# EAGLE schematic untitled (EAGLE 8.0.1)
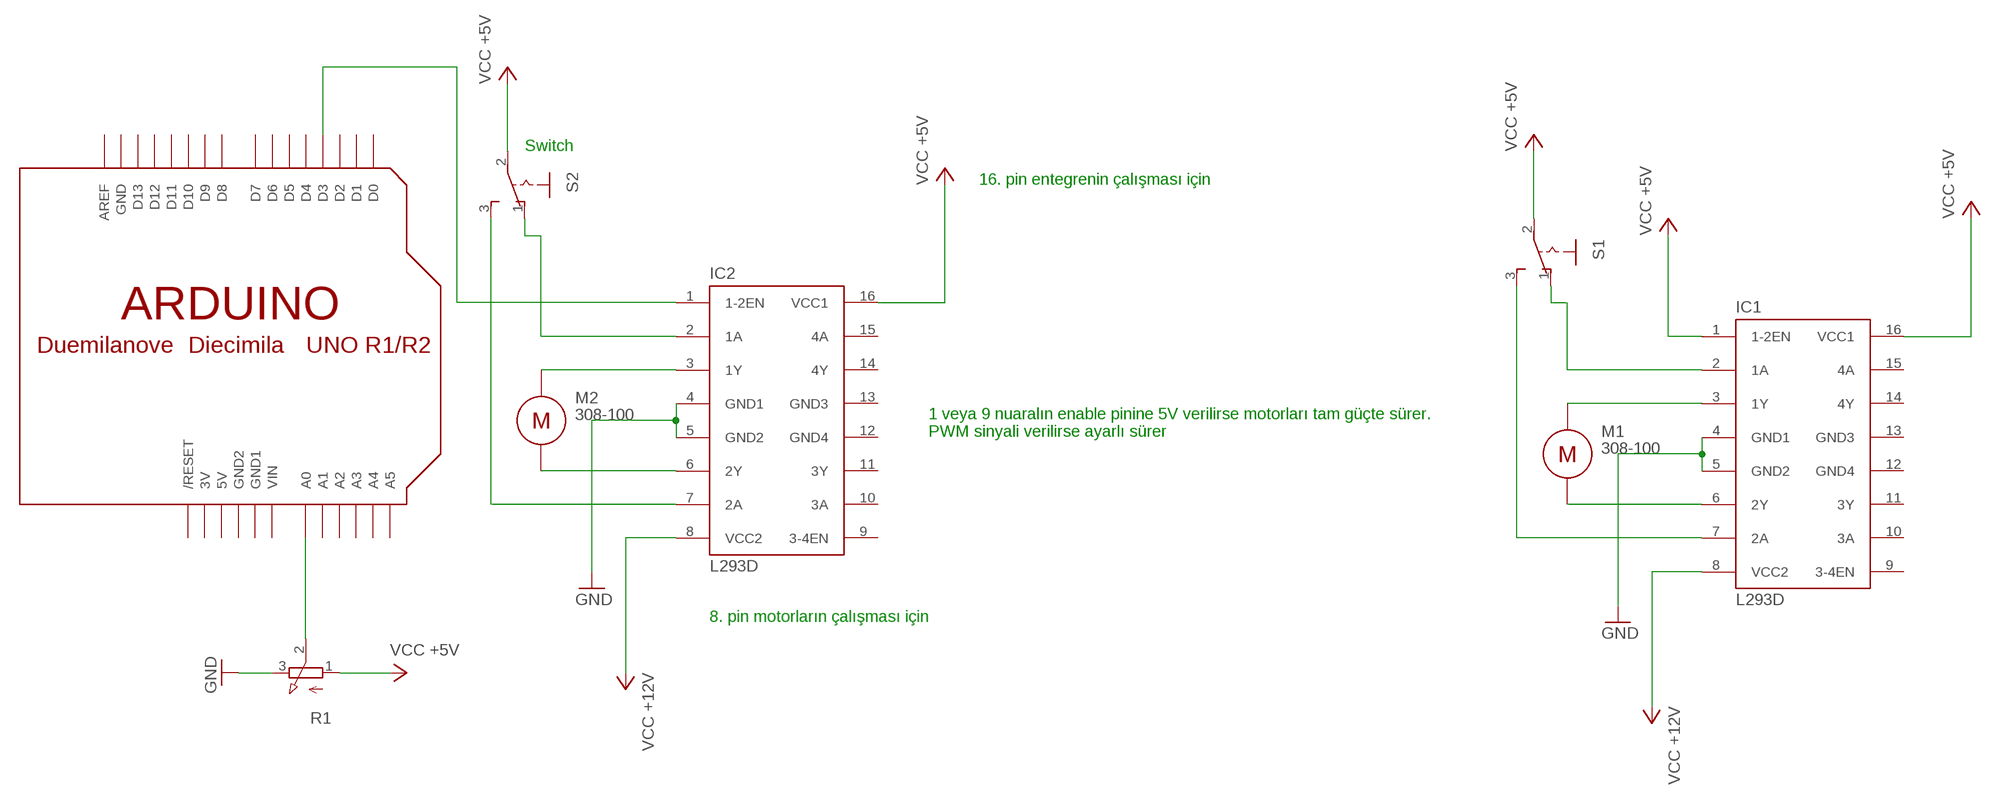
[diagram p0: schematic, sheet 1]

## Parts
IC1  L293D  [DIL16]
IC2  L293D  [DIL16]
M1  308-100  [308-100]
M2  308-100  [308-100]
R1  3RP/1610N  [3RP/1610N]
S1  255SB  [255SB]
S2  255SB  [255SB]
U$1  ARDUINOUNO  [ARDUINO]

## Nets
GND: IC1.4(GND1) IC1.5(GND2) IC2.4(GND1) IC2.5(GND2) R1.3(E)
N$1: IC1.6(2Y) M1.NEG
N$2: IC1.3(1Y) M1.POS
N$3: R1.2(S) U$1.A0
N$4: IC1.2(1A) S1.1(O)
N$5: IC1.7(2A) S1.3(S)
N$7: IC2.6(2Y) M2.NEG
N$8: IC2.3(1Y) M2.POS
N$9: IC2.2(1A) S2.1(O)
N$10: IC2.7(2A) S2.3(S)
N$11: IC2.1(1-2EN) U$1.D3
VCC: IC1.1(1-2EN) IC1.8(VCC2) IC1.16(VCC1) IC2.8(VCC2) IC2.16(VCC1) R1.1(A) S1.2(P) S2.2(P) ; supply symbol labelled VCC +5V, VCC +12V
Unconnected: IC1.9(3-4EN) IC1.10(3A) IC1.11(3Y) IC1.14(4Y) IC1.15(4A) IC2.9(3-4EN) IC2.10(3A) IC2.11(3Y) IC2.14(4Y) IC2.15(4A) U$1.A1 U$1.A2 U$1.A3 U$1.A4 U$1.A5 U$1.AREF U$1.D0 U$1.D1 U$1.D2 U$1.D4 U$1.D5 U$1.D6 U$1.D7 U$1.D8 U$1.D9 U$1.D10 U$1.D11 U$1.D12 U$1.D13 U$1.RESET(/RESET)

## Notes on the sheet
- Switch
- 16. pin entegrenin çalışması için
- 1 veya 9 nuaralın enable pinine 5V verilirse motorları tam güçte sürer.
  PWM sinyali verilirse ayarlı sürer
- 8. pin motorların çalışması için

## Power pins joined to a net without a drawn wire
3V: U$1.3V
5V: U$1.5V
GND: U$1.GND
GND1: U$1.GND1
GND2: U$1.GND2
GND3: IC1.13(GND3) IC2.13(GND3)
GND4: IC1.12(GND4) IC2.12(GND4)
VIN: U$1.VIN

## Library data of the parts
IC1 IC2 = st-microelectronics:L293D: PUSH-PULL 4 CHANNEL DRIVER; MPN: L293D; OC_FARNELL: 9589619; OC_NEWARK: 56P8249
M1 M2 = motor:308-100: Pico Vibe 8mm Vibration Motor - 3mm Type; PRECISION_MICRODRIVES: 308-100
R1 = pot:3RP/1610N: 16mm Potentiometer one level Source: http://www.alphapotentiometers.net/html/16mm_pot_2.html
S1 S2 = switch:255SB: SLIDING SWITCH Distributor Buerklin, 11G810
U$1 = adafruit:ARDUINO: Arduino Diecimila/Duemilanove Make a shield with ease, this package has all the named pins as well as the two mounting drill holes and an outline of the USB and DC power connector. The outline is on the DIMENSION layer, so if your board house uses it they will cut the outline to match. http://www.ladyada.net/library/pcb/eaglelibrary.html